# EAGLE design ComponentCounterLeds-2 (EAGLE 7.4.0)
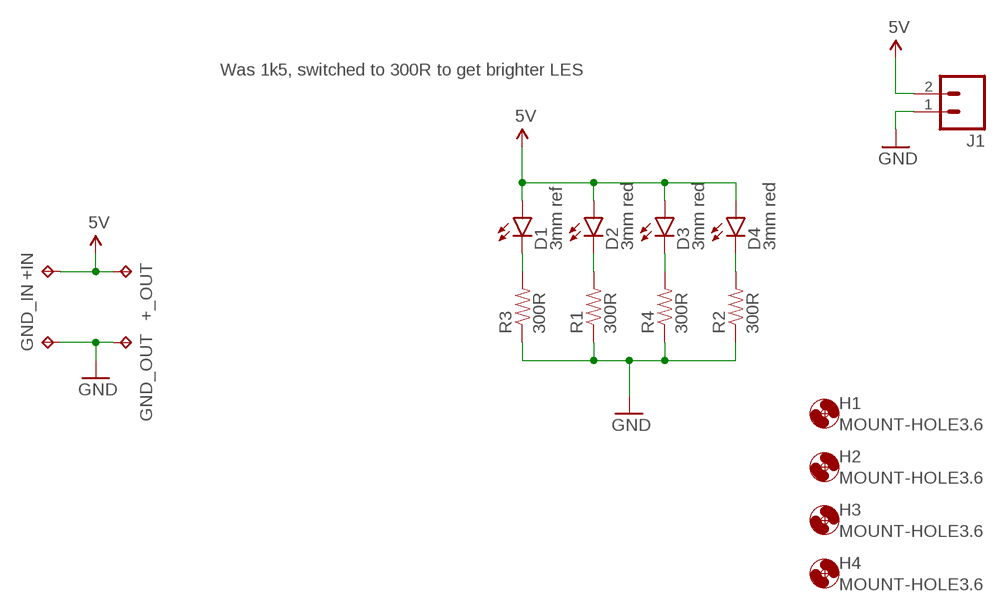
[diagram p0: schematic, sheet 1]

## Parts
+_OUT  TPTP15R  [TP15R]
+IN  TPTP15R  [TP15R]
D1  3mm ref  LED-3MM-NO_SILK  [LED3MM-NS]
D2  3mm red  LED-3MM-NO_SILK  [LED3MM-NS]
D3  3mm red  LED-3MM-NO_SILK  [LED3MM-NS]
D4  3mm red  LED-3MM-NO_SILK  [LED3MM-NS]
GND_IN  TPTP15R  [TP15R]
GND_OUT  TPTP15R  [TP15R]
H1  MOUNT-HOLE3.6  [3,6]
H2  MOUNT-HOLE3.6  [3,6]
H3  MOUNT-HOLE3.6  [3,6]
H4  MOUNT-HOLE3.6  [3,6]
J1  M02-JST-2MM-SMT  [JST-2-SMD]
R1  300R  RESISTOR1206  [1206]
R2  300R  RESISTOR1206  [1206]
R3  300R  RESISTOR1206  [1206]
R4  300R  RESISTOR1206  [1206]

## Nets
5V: +_OUT.TP +IN.TP D1.A D2.A D3.A D4.A J1.2
GND: GND_IN.TP GND_OUT.TP J1.1 R1.1 R2.1 R3.1 R4.1
N$1: D2.K(C) R1.2
N$2: D4.K(C) R2.2
N$3: D3.K(C) R4.2
N$4: D1.K(C) R3.2

## Notes on the sheet
- Was 1k5, switched to 300R to get brighter LES

## Library data of the parts
+_OUT +IN GND_IN GND_OUT = testpad:TP: Test pad
D1-D4 = SparkFun-LED:LED: LEDs Standard schematic elements and footprints for 5mm, 3mm, 1206, and 0603 sized LEDs. 5mm - Spark Fun Electronics SKU : COM-00529 (and others)
H1-H4 = holes:MOUNT-HOLE: MOUNTING HOLE with drill center marker
J1 = SparkFun-Connectors:M02: Standard 2-pin 0.1" header. Use with - straight break away headers ( PRT-00116) - right angle break away headers (PRT-00553) - swiss pins (PRT-00743) - machine pins (PRT-00117) - female headers (PRT-00115) Molex polarized connector foot print use with: PRT-08233 with associated crimp pins and housings. 2.54_SCREWTERM for use with PRT-10571. 3.5mm Screw Terminal footprints for PRT-08084 5mm Screw Terminal footprints for use with PRT-08432; FARNELL: 9492615; PROD_ID: CONN-11443
R1-R4 = SparkFun-Resistors:RESISTOR: Resistor Basic schematic elements and footprints for 0603, 1206, and PTH resistors.

## Board
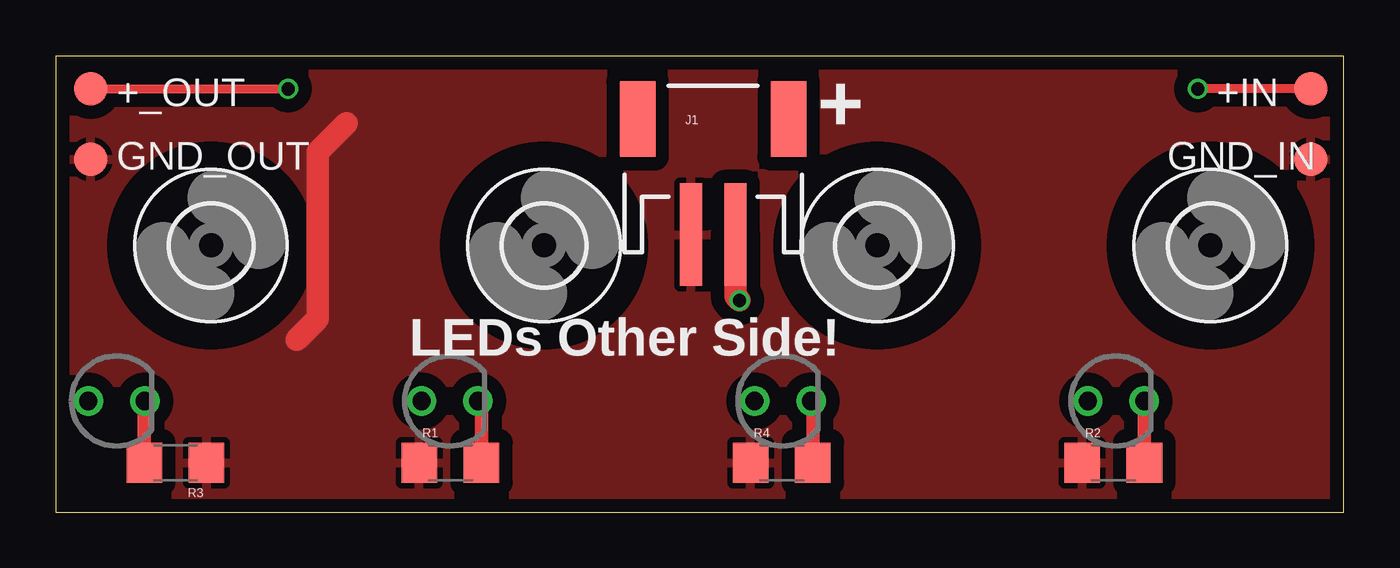
[diagram p1: board, top side]
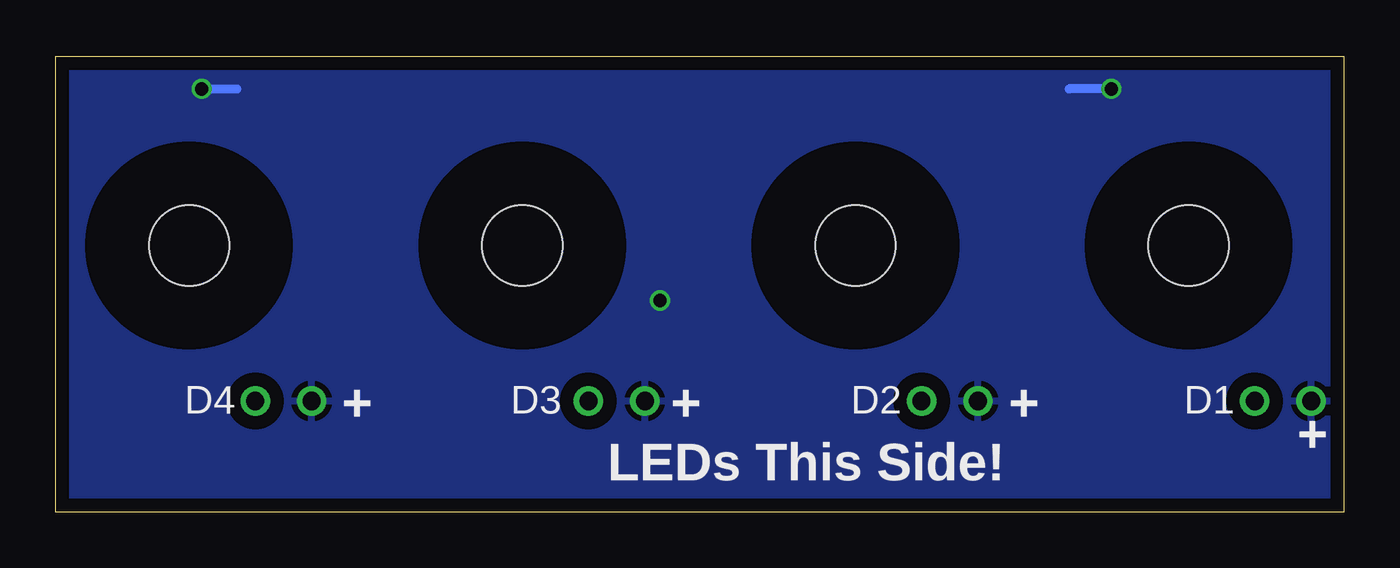
[diagram p2: board, bottom side, seen from below]

Size 58 x 20.51 mm. Coordinates in mm from the lower left corner, seen from the top.
Outline: 0,0 58,0 58,20.51 0,20.51 0,0
Copper layers (1*16): Top 0.035mm / dielectric 1.5mm / Bottom 0.035mm
Design rules "dirt_cheap_dirty_boards.v1": minimum track width 5mil, minimum drill 12mil, track to track 5mil, track to pad 5mil, pad to pad 5mil, via to via 5mil, smd to smd 0mil, copper to edge 10mil, drill to drill 10mil, minimum pad ring 10mil, minimum via ring 6mil, stop-mask expansion 2mil, vias tented up to drill 25mil, thermal gap 10mil

### Footprints (pad centres in the part's own frame; a part is rotated, then mirrored left to right if it is on the bottom)
TP15R = smd 1.5 x 1.5: TP 0,0
LED3MM-NS = drill 0.813: A -1.27,0; K 1.27,0
3,6 = hole 3.6: 0,0
JST-2-SMD = smd 1 x 4.6: 1 -1,-3.7; 2 1,-3.7 | smd 1.6 x 3.4: NC1 -3.4,1.5; NC2 3.4,1.5
1206 = smd 1.6 x 1.8: 1 -1.4,0; 2 1.4,0

### Placement (x,y rotation side)
+_OUT  1.59,19.05 0 top
+IN  56.52,19.05 0 top
D1  2.75,5 0 top
D2  17.75,5 0 top
D3  32.75,5 0 top
D4  47.75,5 0 top
GND_IN  56.52,15.88 0 top
GND_OUT  1.59,15.88 0 top
H1  7,12 0 top
H2  22,12 0 top
H3  37,12 0 top
H4  52,12 0 top
J1  29.61,16.19 0 top
R1  17.78,2.22 0 top
R2  47.62,2.22 0 top
R3  5.4,2.22 180 top
R4  32.7,2.22 0 top

### Tracks (layer width: path | path; a pad name or v marks a point on that pad's centre or on a via)
5V  (via drill 0.6)
  Top 0.406: +IN.TP v51.44,19.05 | +_OUT.TP v10.48,19.05
  Top 1.016: J1.2 30.61,9.71 v30.8,9.53
  Bottom 0.406: v51.44,19.05 49.85,19.05 | v10.48,19.05 12.38,19.05
  pour Bottom (isolate 0.61): -0.5,24.13 -0.5,0 58.42,-0.32 58.42,23.81
GND
  Top 1.016: 10.85,7.75 11.8,8.7 11.8,16.2 13.1,17.5
  pour Top (isolate 0.61): 0,24.13 58.42,24.13 58.42,-0.32 0,-0.32
N$1
  Top 0.61: D2.K 19.18,4.68 R1.2
N$2
  Top 0.61: D4.K 49.02,4.05 R2.2
N$3
  Top 0.61: D3.K 34.1,4.68 R4.2
N$4
  Top 0.61: D1.K 4,5 R3.2

### Text on the board
tNames: + | LEDs Other Side!
bNames: + | + | + | + | LEDs This Side!
Measures: 7mm between LED and screw hole | 3.75mm offset from left hand edge | LED is 3.75mm offset from left hand edge | 0 is 0.5mm from left hand edge, so led is 3.25 from zero | screw is 6.5 from left, so 6.0 from 0 | Unit repeats every 13mm